# Altium schematic sheet AD8361.SchDoc
size A4
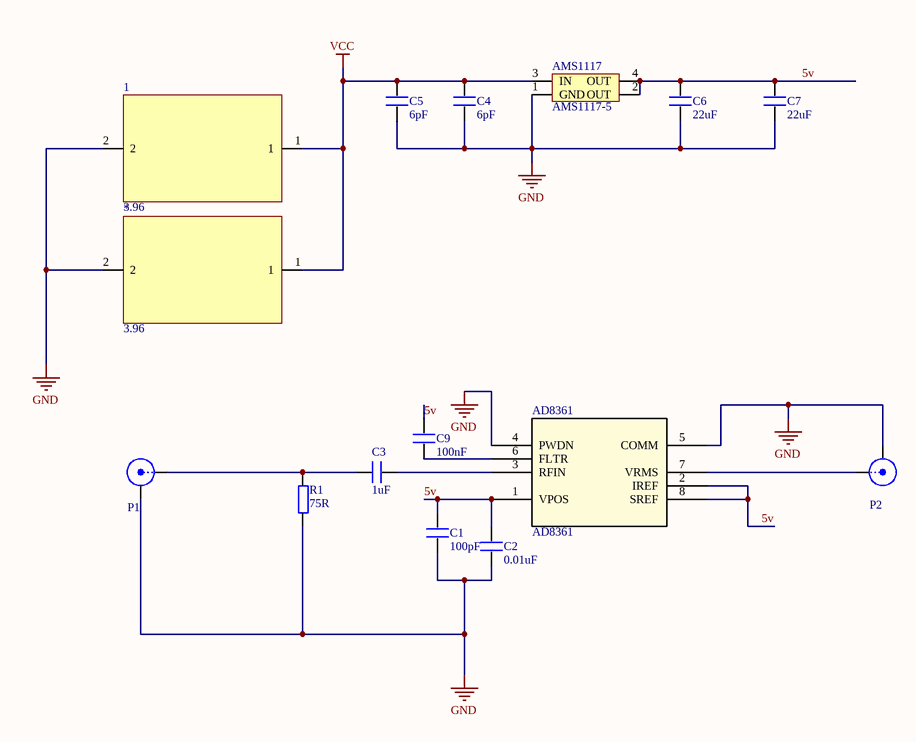
[diagram p0: AD8361.SchDoc]

## Parts
1  3.96  [3.96]
*  3.96  [3.96]
AD8361  AD8361  [RM_8]
AMS1117  AMS1117-5  [AMS1117]
C1  100pF  [0603C]
C2  0.01uF  [0603C]
C3  1uF  [0603C]
C4  6pF  [0603C]
C5  6pF  [1206C]
C6  22uF  [1206C]
C7  22uF  [0603C]
C9  100nF  [0603C]
P1  SMA  [SMA]  (value not drawn)
P2  SMA  [SMA]  (value not drawn)
R1  75R  [0603R]

## Nets
GND: 1.2 *.2 AD8361.4(PWDN) AD8361.5(COMM) AMS1117.1(GND) C1.1 C2.1 C4.1 C5.1 C6.1 C7.1 P1.2(Y) P2.2(Y) R1.1
VCC: 1.1 *.1 AMS1117.3(IN) C4.2 C5.2
5v: AD8361.1(VPOS) AD8361.2(IREF) AD8361.8(SREF) AMS1117.2(OUT) AMS1117.4(OUT) C1.2 C2.2 C6.2 C7.2 C9.2
NetAD8361_3: AD8361.3(RFIN) C3.1
NetAD8361_6: AD8361.6(FLTR) C9.1
NetAD8361_7: AD8361.7(VRMS) P2.1(X)
NetC3_2: C3.2 P1.1(X) R1.2

## Library data of the parts
AD8361 = AD8361: LF至2.5 GHz TruPwr™检波器; Manufacturer_Part_Number: AD8361ARMZ; Vendor: Analog Devices Inc; Built_By: Analog_Devices_Team; Copyright: Copyright (C) 2018 Accelerated Designs. All rights reserved; RefDes: RefDes; Type: DEV; Value: Value
AMS1117 = AMS1117
C1-C7 C9 = C: Capacitor
P1 P2 = SMA: SMA Connector
R1 = Resistor